# EAGLE design rpi-psu (EAGLE 6.5.0)
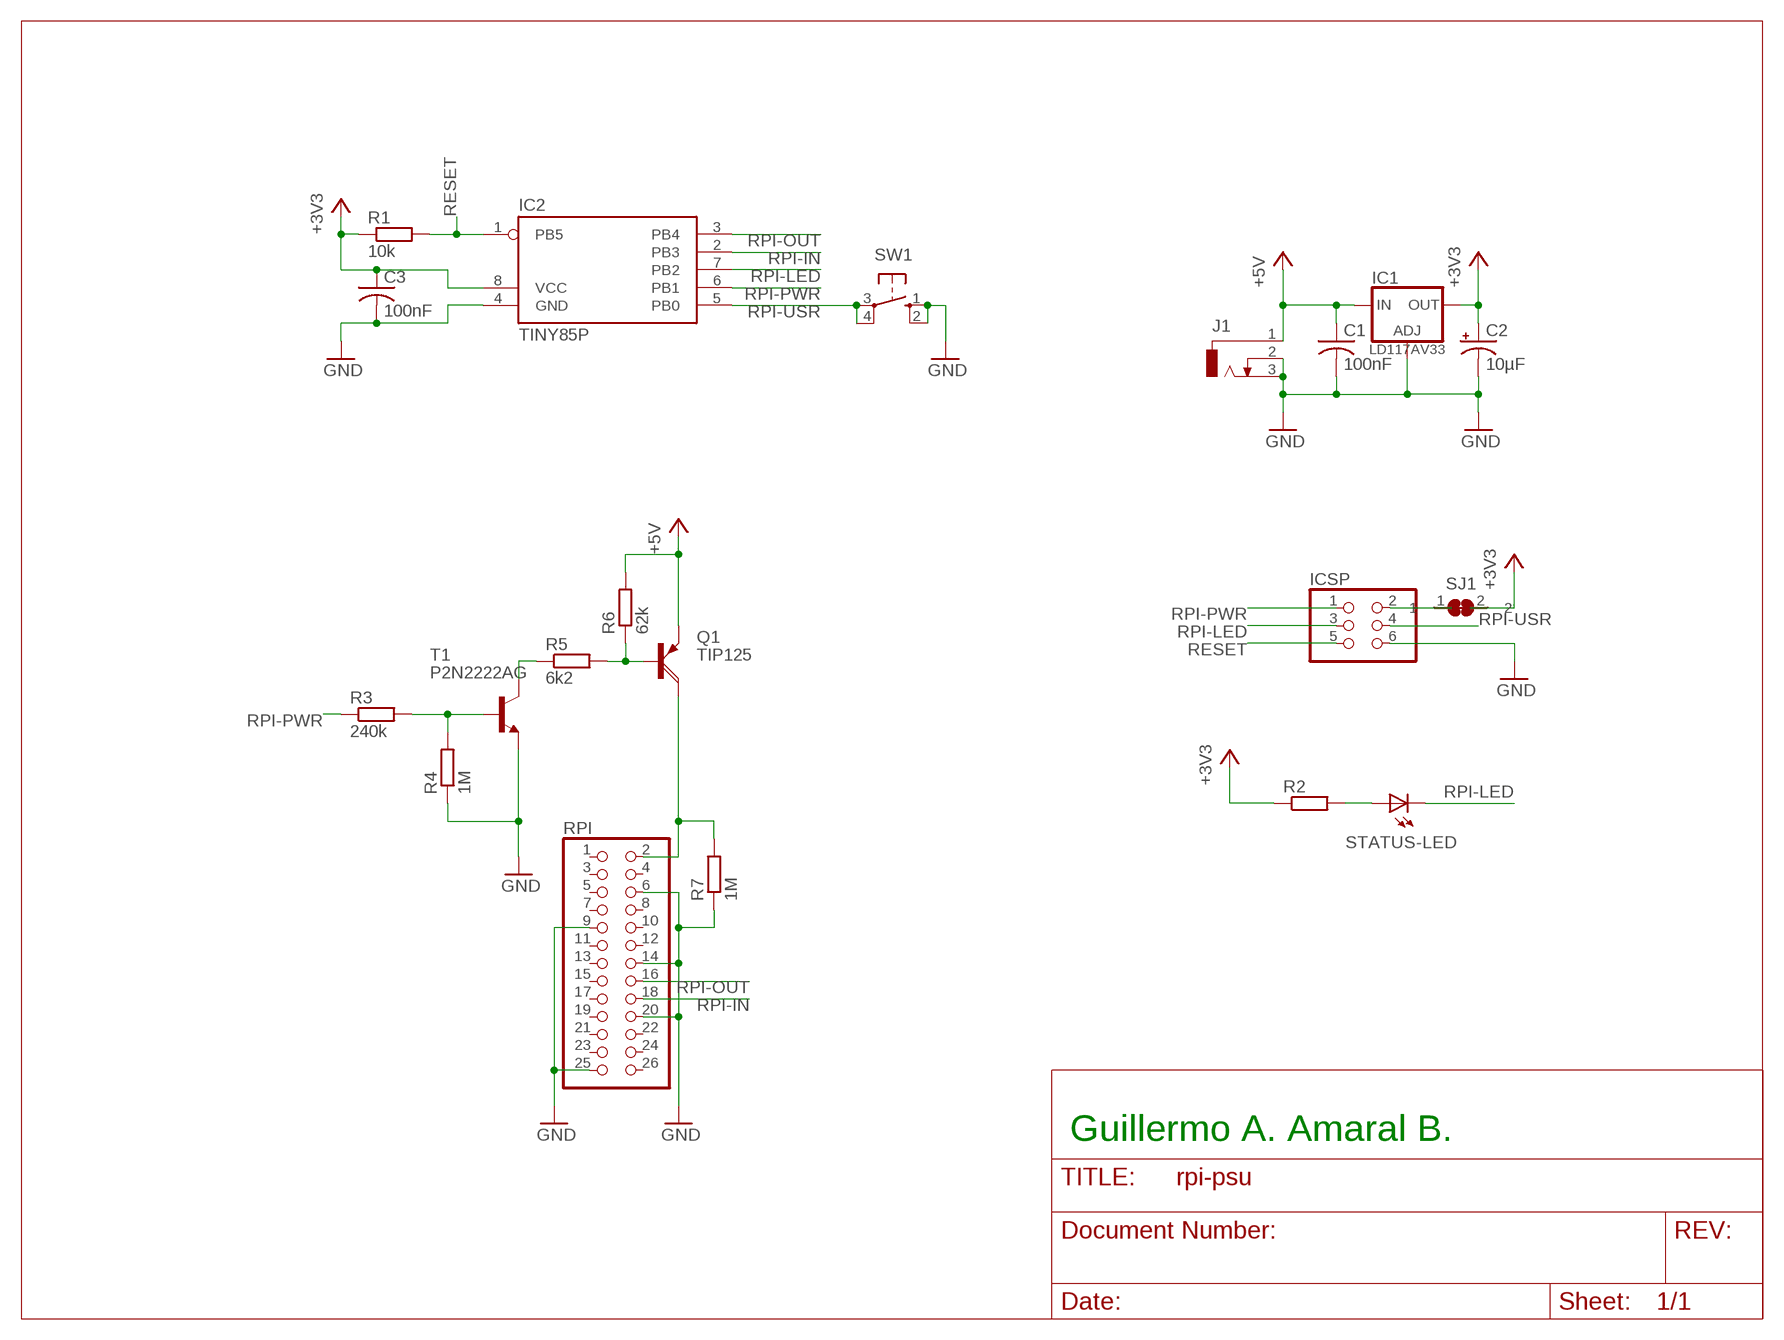
[diagram p0: schematic, sheet 1]

## Parts
C1  100nF  C-US050-024X044  [C050-024X044]
C2  10µF  CPOL-USE2,5-6E  [E2,5-6E]
C3  100nF  C-US050-024X044  [C050-024X044]
IC1  LD117AV33  [TO220L1]
IC2  TINY85P  [DIL08]
ICSP  PINHD-2X3  [2X03]
J1  DCJ0303  [DCJ0303]
Q1  TIP125  [TO220AH]
R1  10k  R-EU_0207/10  [0207/10]
R2  R-EU_0207/10  [0207/10]
R3  240k  R-EU_0207/10  [0207/10]
R4  1M  R-EU_0207/10  [0207/10]
R5  6k2  R-EU_0207/10  [0207/10]
R6  62k  R-EU_0207/10  [0207/10]
R7  1M  R-EU_0207/10  [0207/10]
RPI  PINHD-2X13  [2X13]
SJ1  SJ-BRIDGED  [SJ-BRIDGED]
STATUS-LED  LED5MM  [LED5MM]
SW1  10-XX  [B3F-10XX]
T1  P2N2222AG  2N3904  [TO92]

## Nets
+3V3: C2.+ C3.1 IC1.2(OUT) IC2.8(VCC) R1.1 R2.1 SJ1.2
+5V: C1.1 IC1.3(IN) J1.1 Q1.E R6.2
GND: C1.2 C2.- C3.2 IC1.1(ADJ) IC2.4(GND) ICSP.6 J1.2 J1.3 R4.1 R7.1 RPI.6 RPI.9 RPI.14 RPI.20 RPI.25 SW1.1(S) SW1.2(S1) T1.3(E)
ICSP-VCC: ICSP.2 SJ1.1
N$1: R2.2 STATUS-LED.A
N$3: Q1.C R7.2 RPI.2
N$4: Q1.B R5.2 R6.1
N$5: R3.2 R4.2 T1.2(B)
N$6: R5.1 T1.1(C)
RESET: IC2.1(PB5) ICSP.5 R1.2
RPI-IN: IC2.2(PB3) RPI.18
RPI-LED: IC2.7(PB2) ICSP.3 STATUS-LED.K(C)
RPI-OUT: IC2.3(PB4) RPI.16
RPI-PWR: IC2.6(PB1) ICSP.1 R3.1
RPI-USR: IC2.5(PB0) ICSP.4 SW1.3(P) SW1.4(P1)
Unconnected: RPI.1 RPI.3 RPI.4 RPI.5 RPI.7 RPI.8 RPI.10 RPI.11 RPI.12 RPI.13 RPI.15 RPI.17 RPI.19 RPI.21 RPI.22 RPI.23 RPI.24 RPI.26

## Notes on the sheet
- Guillermo A. Amaral B.

## Library data of the parts
C1 C3 = resistor:C-US: CAPACITOR, American symbol
C2 = resistor:CPOL-US: POLARIZED CAPACITOR, American symbol
IC1 = v-reg:LD117A?*: Low drop fixed and adjustable positive voltage regulators 1 A Source: http://www.st.com/stonline/products/literature/ds/7194/ld1117axx.pdf
IC2 = gamaral:TINY85: AVR ATtiny85 MICROCONTROLLER 8K ISPF 256 bytes SRAM 512 bytes EEPROM
ICSP = pinhead:PINHD-2X3: PIN HEADER
J1 = con-jack:DCJ0303: DC POWER JACK Source: DCJ0303.pdf; OC_FARNELL: unknown; OC_NEWARK: unknown
Q1 = transistor-power:TIP125: PNP DARLINGTON TRANSISTOR
R1-R7 = resistor:R-EU_: RESISTOR, European symbol
RPI = pinhead:PINHD-2X13: PIN HEADER
SJ1 = gamaral:SJ-BRIDGED: Solder Jumper - Bridged
STATUS-LED = led:LED: LED OSRAM: - CHIPLED LG R971, LG N971, LY N971, LG Q971, LY Q971, LO R971, LY R971 LH N974, LH R974 LS Q976, LO Q976, LY Q976 LO Q996 - Hyper CHIPLED LW Q18S LB Q993, LB Q99A, LB R99A - SideLED LS A670, LO A670, LY A670, LG A670, LP A670 LB A673, LV A673, LT A673, LW A673 LH A674 LY A675 LS A676, LA A676, LO A676, LY A676, LW A676 LS A679, LY A679, LG A679 - Hyper Micro SIDELED® LS Y876, LA Y876, LO Y876, LY Y876 LT Y87S - SmartLED LW L88C, LW L88S LB L89C, LB L89S, LG L890 LS L89K, LO L89K, LY L89K LS L896, LA L896, LO L896, LY L896 - TOPLED LS T670, LO T670, LY T670, LG T670, LP T670 LSG T670, LSP T670, LSY T670, LOP T670, LYG T670 LG T671, LOG T671, LSG T671 LB T673, LV T673, LT T673, LW T673 LH T674 LS T676, LA T676, LO T676, LY T676, LB T676, LH T676, LSB T676, LW T676 LB T67C, LV T67C, LT T67C, LS T67K, LO T67K, LY T67K, LW E67C LS E67B, LA E67B, LO E67B, LY E67B, LB E67C, LV E67C, LT E67C LW T67C LS T679, LY T679, LG T679 LS T770, LO T770, LY T770, LG T770, LP T770 LB T773, LV T773, LT T773, LW T773 LH T774 LS E675, LA E675, LY E675, LS T675 LS T776, LA T776, LO T776, LY T776, LB T776 LHGB T686 LT T68C, LB T68C - Hyper Mini TOPLED® LB M676 - Mini TOPLED Santana® LG M470 LS M47K, LO M47K, LY M47K Source: http://www.osram.convergy.de LUXEON: - LUMILED® LXK2-PW12-R00, LXK2-PW12-S00, LXK2-PW14-U00, LXK2-PW14-V00 LXK2-PM12-R00, LXK2-PM12-S00, LXK2-PM14-U00 LXK2-PE12-Q00, LXK2-PE12-R00, LXK2-PE12-S00, LXK2-PE14-T00, LXK2-PE14-U00 LXK2-PB12-K00, LXK2-PB12-L00, LXK2-PB12-M00, LXK2-PB14-N00, LXK2-PB14-P00, LXK2-PB14-Q00 LXK2-PR12-L00, LXK2-PR12-M00, LXK2-PR14-Q00, LXK2-PR14-R00 LXK2-PD12-Q00, LXK2-PD12-R00, LXK2-PD12-S00 LXK2-PH12-R00, LXK2-PH12-S00 LXK2-PL12-P00, LXK2-PL12-Q00, LXK2-PL12-R00 Source: www.luxeon.com KINGBRIGHT: KA-3528ASYC Source: www.kingbright.com
SW1 = switch-omron:10-XX: OMRON SWITCH; MPN: B3F-1000; OC_FARNELL: 176432; OC_NEWARK: 36M3542
T1 = transistor:2N3904: NPN TRANSISTOR

## Board
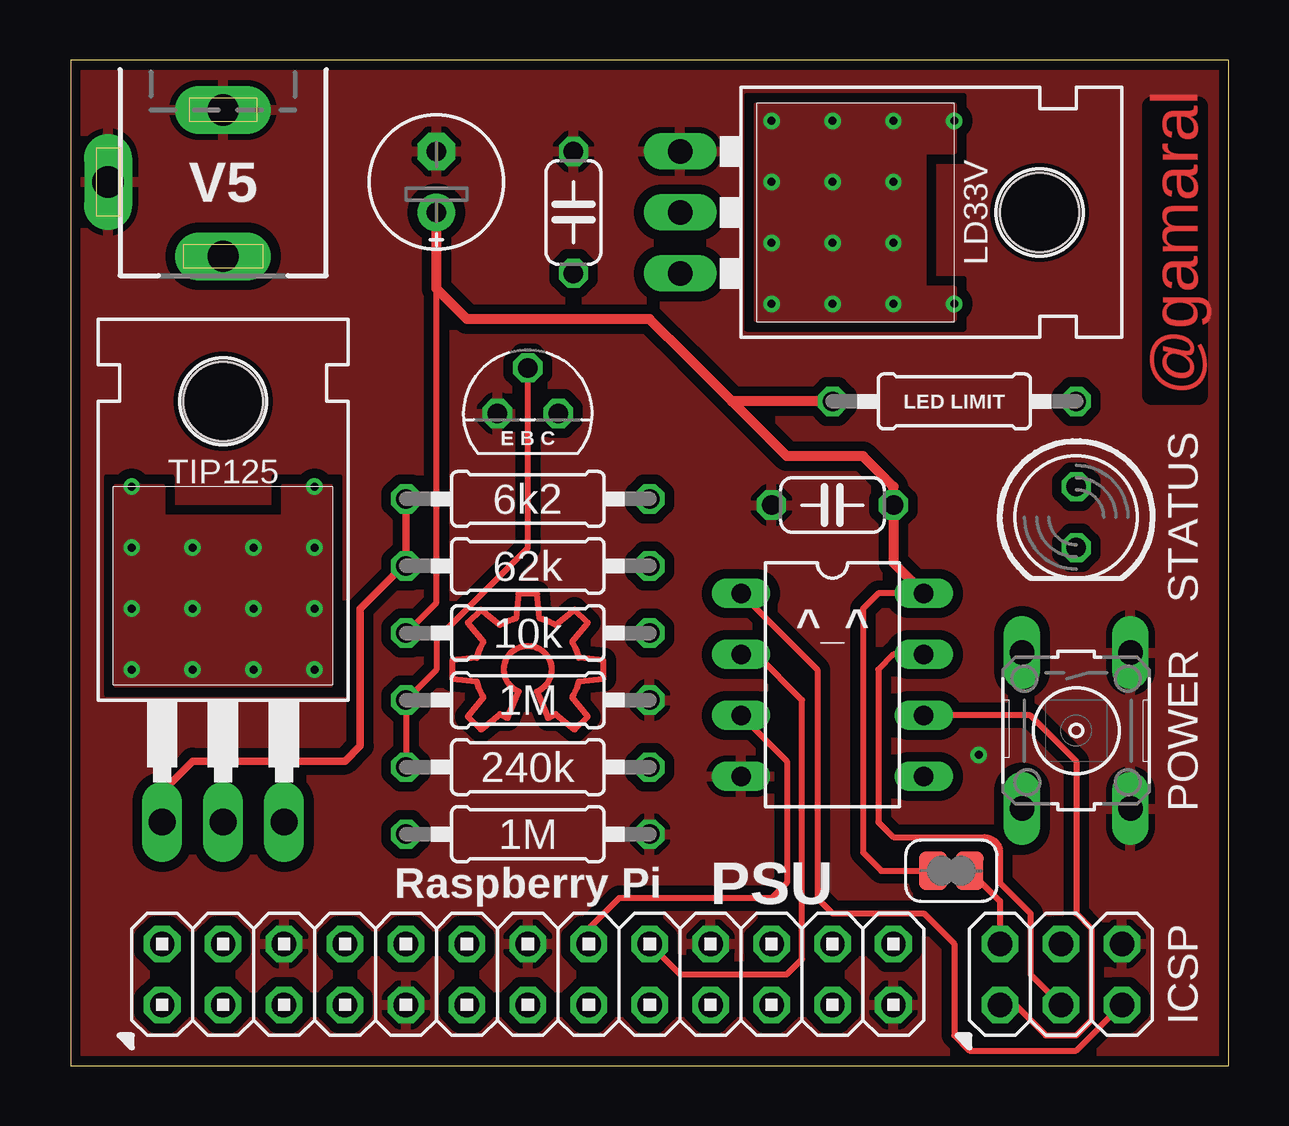
[diagram p1: board, top side]
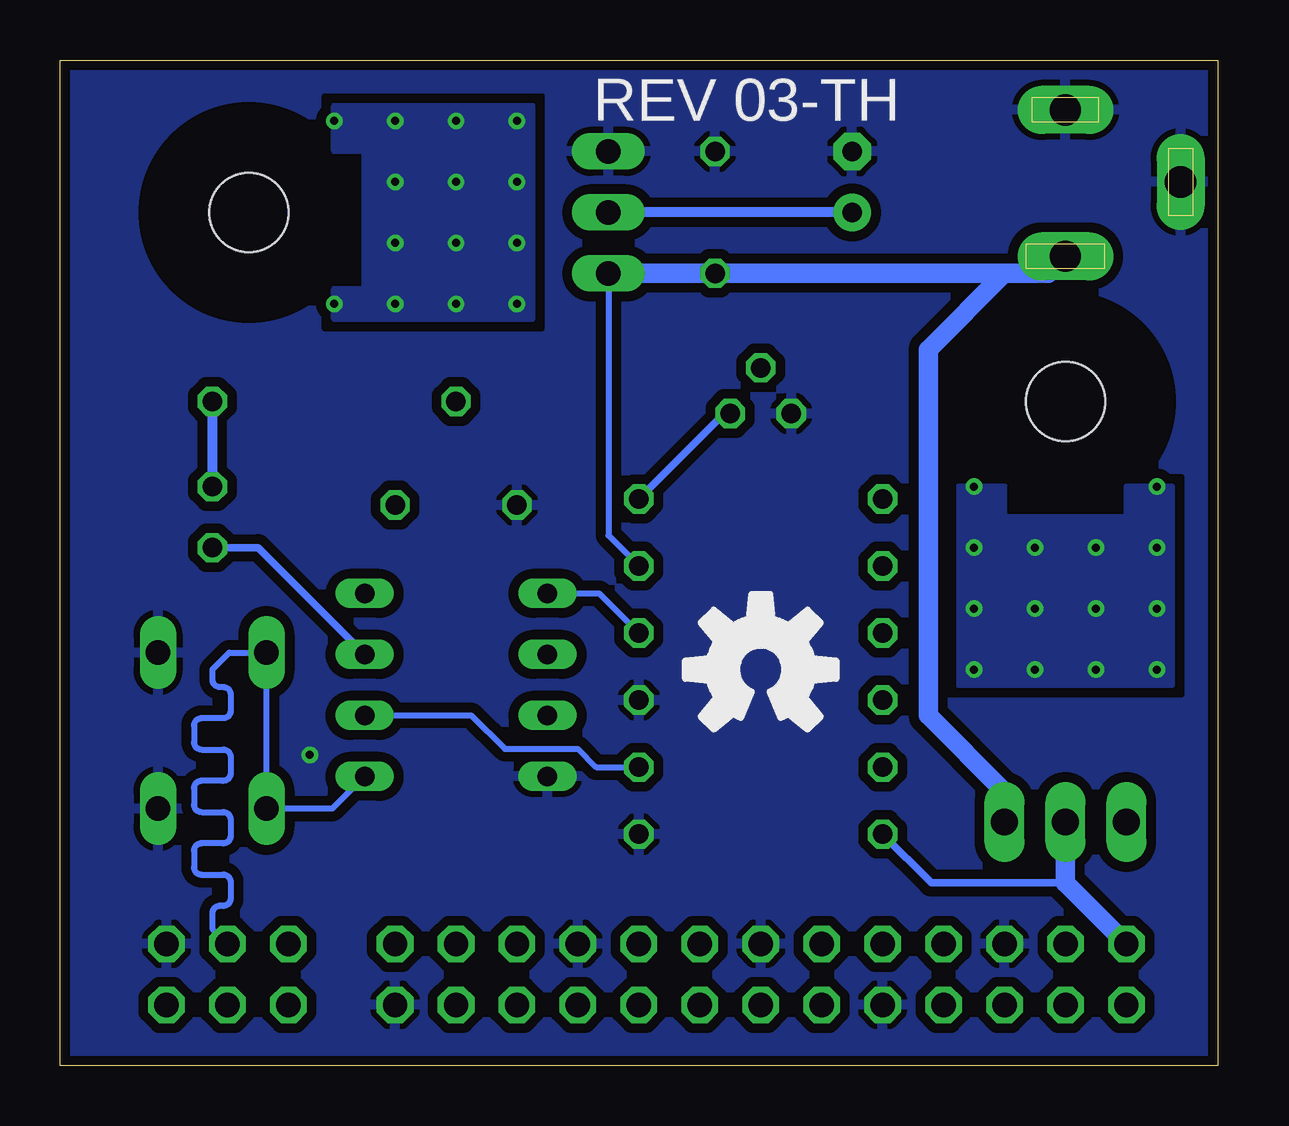
[diagram p2: board, bottom side, seen from below]

Size 48.26 x 41.91 mm. Coordinates in mm from the lower left corner, seen from the top.
Outline: 0,0 48.26,0 48.26,41.91 0,41.91 0,0
Copper layers (1*16): Top 0.0356mm / dielectric 1.5011mm / Bottom 0.0356mm
Design rules "LaenPCBOrder": minimum track width 6mil, minimum drill 13mil, track to track 6mil, track to pad 6mil, pad to pad 6mil, via to via 6mil, smd to smd 6mil, copper to edge 15mil, drill to drill 6mil, minimum pad ring 7mil, minimum via ring 7mil, stop-mask expansion 4mil, vias tented up to drill 0mil, thermal gap 10mil

### Footprints (pad centres in the part's own frame; a part is rotated, then mirrored left to right if it is on the bottom)
C050-024X044 = drill 0.813 octagon: 1 -2.54,0; 2 2.54,0
E2,5-6E = drill 0.813 pad 1.575: + -1.27,0 | drill 0.813 pad 1.575 octagon: - 1.27,0
TO220L1 = drill 1.016 long: 1 -2.54,-3.81; 2 0,-3.81; 3 2.54,-3.81 | hole 3.302: 0,11.176
DIL08 = drill 0.813 long: 1 -3.81,-3.81; 2 -1.27,-3.81; 3 1.27,-3.81; 4 3.81,-3.81; 5 3.81,3.81; 6 1.27,3.81; 7 -1.27,3.81; 8 -3.81,3.81
2X03 = drill 1.016 octagon: 1 -2.54,-1.27; 2 -2.54,1.27; 3 0,-1.27; 4 0,1.27; 5 2.54,-1.27; 6 2.54,1.27
DCJ0303 = drill 1.3 pad 2 long: 1 0,3.1; 2 4.8,0; 3 0,-3
TO220AH = drill 1.118 long: B -2.54,-6.35; C 0,-6.35; E 2.54,-6.35 | hole 3.302: 0,11.176
0207/10 = drill 0.813 octagon: 1 -5.08,0; 2 5.08,0
2X13 = drill 1.016 octagon: 1 -15.24,-1.27; 2 -15.24,1.27; 3 -12.7,-1.27; 4 -12.7,1.27; 5 -10.16,-1.27; 6 -10.16,1.27; 7 -7.62,-1.27; 8 -7.62,1.27; 9 -5.08,-1.27; 10 -5.08,1.27; 11 -2.54,-1.27; 12 -2.54,1.27; 13 0,-1.27; 14 0,1.27; 15 2.54,-1.27; 16 2.54,1.27; 17 5.08,-1.27; 18 5.08,1.27; 19 7.62,-1.27; 20 7.62,1.27; 21 10.16,-1.27; 22 10.16,1.27; 23 12.7,-1.27; 24 12.7,1.27; 25 15.24,-1.27; 26 15.24,1.27
SJ-BRIDGED = smd 1.168 x 1.6: 1 -0.762,0; 2 0.762,0
LED5MM = drill 0.813 octagon: A -1.27,0; K 1.27,0
B3F-10XX = drill 1.016 long: 1 -3.251,2.261; 2 3.251,2.261; 3 -3.251,-2.261; 4 3.251,-2.261
TO92 = drill 0.813 octagon: 1 1.27,0; 2 0,1.905; 3 -1.27,0

### Placement (x,y rotation side)
C1  20.95,35.56 90 top
C2  15.24,36.83 90 top
C3  31.75,23.37 180 top
IC1  29.21,35.56 270 top
IC2  31.75,15.88 270 top
ICSP  41.27,3.81 0 top
J1  6.35,36.83 180 top
Q1  6.35,16.51 0 top
R1  19.05,18.03 0 top
R2  36.83,27.69 0 top
R3  19.05,12.45 180 top
R4  19.05,15.24 180 top
R5  19.05,23.62 180 top
R6  19.05,20.83 0 top
R7  19.05,9.65 180 top
RPI  19.05,3.81 0 top
SJ1  36.7,8.13 180 top
STATUS-LED  41.91,22.86 270 top
SW1  41.91,13.97 270 top
T1  19.05,27.18 0 top

### Tracks (layer width: path | path; a pad name or v marks a point on that pad's centre or on a via)
+3V3
  Top 0.254: IC2.8 33.66,19.68 33.02,19.05 33.02,8.89 33.78,8.13 SJ1.2 | R1.1 15.24,19.3 15.24,32.38
  Top 0.406: C2.+ 15.24,32.38 16.51,31.11 24.13,31.11 25.72,29.53 27.56,27.69 | IC2.8 34.29,20.95 C3.1 34.29,24.13 33.02,25.4 29.84,25.4 27.56,27.69 | R2.1 27.56,27.69
  Bottom 0.406: C2.+ IC1.2
+5V
  Bottom 0.254: IC1.3 25.4,22.1 R6.2
  Bottom 0.813: J1.1 7.06,33.02 8.89,33.02 | 8.89,33.02 C1.1 IC1.3 | Q1.E 8.89,11.43 12.06,14.61 12.06,29.84 8.89,33.02
GND  (via drill 0.33)
  other vias: 37.85,12.95
  pour Top (isolate 0.406, rank 2): 0,41.91 48.26,41.91 48.26,0 0,0
  pour Bottom (isolate 0.406, rank 2): 0,41.91 48.26,41.91 48.26,0 0,0
HS1  (via drill 0.33)
  other vias: 36.83,39.37 34.29,39.37 31.75,39.37 29.21,39.37 29.21,31.75 31.75,31.75 34.29,31.75 36.83,31.75 29.21,34.29 29.21,36.83 31.75,36.83 31.75,34.29 34.29,34.29 34.29,36.83
  pour Top (no thermals): 28.57,40.01 28.57,31.11 36.83,31.11 36.83,32.38 35.56,32.38 35.56,38.1 36.83,38.1 36.83,40.01
  pour Bottom (no thermals): 28.57,40.01 28.57,31.11 36.83,31.11 36.83,32.38 35.56,32.38 35.56,38.1 36.83,38.1 36.83,40.01
HS2  (via drill 0.33)
  other vias: 2.54,24.13 10.16,24.13 10.16,16.51 2.54,16.51 2.54,19.05 2.54,21.59 10.16,21.59 10.16,19.05 7.62,19.05 5.08,19.05 5.08,21.59 7.62,21.59 7.62,16.51 5.08,16.51
  pour Top: 1.91,24.13 3.81,24.13 3.81,22.86 8.89,22.86 8.89,24.13 10.79,24.13 10.79,15.88 1.91,15.88
  pour Bottom: 1.91,24.13 3.81,24.13 3.81,22.86 8.89,22.86 8.89,24.13 10.79,24.13 10.79,15.88 1.91,15.88
ICSP-VCC
  Top 0.254: SJ1.1 38.73,6.86 ICSP.2
N$1
  Bottom 0.406: R2.2 STATUS-LED.A
N$2
  Top 0.254: 19.89,14.49 arc10 20.21,14.66 21,14.01 21.55,14.55 20.9,15.35 arc19 21.18,16.02 22.2,16.12 22.2,16.9 21.18,17 arc19 20.9,17.67 21.55,18.46 21,19.01 20.21,18.36 arc19 19.54,18.64 19.44,19.66 18.66,19.66 18.56,18.64 arc19 17.89,18.36 17.09,19.01 16.55,18.46 17.2,17.67 arc19 16.92,17 15.9,16.9 15.9,16.12 16.92,16.02 arc19 17.2,15.35 16.55,14.55 17.09,14.01 17.89,14.66 arc10 18.21,14.49 18.67,15.59 arc-68 18.06,16.51 arc-248 19.43,15.59 19.89,14.49
N$3
  Bottom 0.305: R7.2 11.94,7.62 6.35,7.62
  Bottom 0.813: RPI.2 6.35,7.62 Q1.C
N$4
  Top 0.254: 13.84,20.83 R6.1
  Top 0.305: R5.2 R6.1 | Q1.B 3.81,11.43 5.08,12.7 11.43,12.7 12.06,13.34 12.06,19.05 13.84,20.83
N$5
  Top 0.254: T1.2 19.05,21.59 15.24,17.78 15.24,16.51 R4.2 R3.2
N$6
  Bottom 0.305: R5.1 20.57,27.18 T1.1
RESET
  Top 0.254: IC2.1 31.11,16.51 31.11,6.99 31.75,6.35 35.56,6.35 36.83,5.08 36.83,1.27 37.47,0.64 41.91,0.64 ICSP.5
  Bottom 0.254: IC2.1 25.78,19.68 R1.2
RPI-IN
  Top 0.254: RPI.18 25.4,3.81 29.84,3.81 30.48,4.45 30.48,15.24 28.57,17.14 IC2.2
RPI-LED
  Top 0.254: IC2.7 34.29,17.14 33.66,16.51 33.66,10.16 34.29,9.53 38.1,9.53 arc-90 38.73,8.89 38.73,7.62 40.01,6.35 40.01,3.81 ICSP.3
  Bottom 0.305: STATUS-LED.K 40.01,21.59 IC2.7
RPI-OUT
  Top 0.254: IC2.3 29.84,12.7 29.84,7.62 29.21,6.99 22.86,6.99 21.59,5.71 RPI.16
RPI-PWR
  Top 0.254: ICSP.1 39.37,2.54 40.64,1.27 41.91,1.27 42.55,1.91 42.55,5.71 41.91,6.35 41.91,12.7 40.01,14.61 IC2.6
  Bottom 0.254: IC2.6 31.11,14.61 29.72,13.21 26.67,13.21 25.91,12.45 R3.1
RPI-USR
  Bottom 0.254: IC2.5 36.91,10.72 SW1.4 SW1.3 41.2,17.22 41.91,16.51 41.91,16.1 arc-90 41.59,15.79 41.46,15.79 arc90 41.14,15.47 41.14,14.8 arc90 41.46,14.48 42.36,14.48 arc-90 42.68,14.17 42.68,13.5 arc-90 42.36,13.18 41.46,13.18 arc90 41.14,12.86 41.14,12.2 arc90 41.46,11.88 42.36,11.88 arc-90 42.68,11.56 42.68,10.89 arc-90 42.36,10.57 41.46,10.57 arc90 41.14,10.26 41.14,9.59 arc90 41.46,9.27 42.36,9.27 arc-90 42.68,8.96 42.68,8.29 arc-90 42.36,7.97 41.46,7.97 arc90 41.14,7.65 41.14,6.99 arc90 41.46,6.67 41.59,6.67 arc-90 41.91,6.35 41.91,5.71 ICSP.4
  Bottom 0.406: 39.65,16.15 SW1.3

### Text on the board
Top: @gamaral
tPlace: E B C
tNames: V5 | LD33V | LED LIMIT | TIP125 | STATUS | ^_^ | POWER | Raspberry Pi | PSU
bNames: REV 03-TH